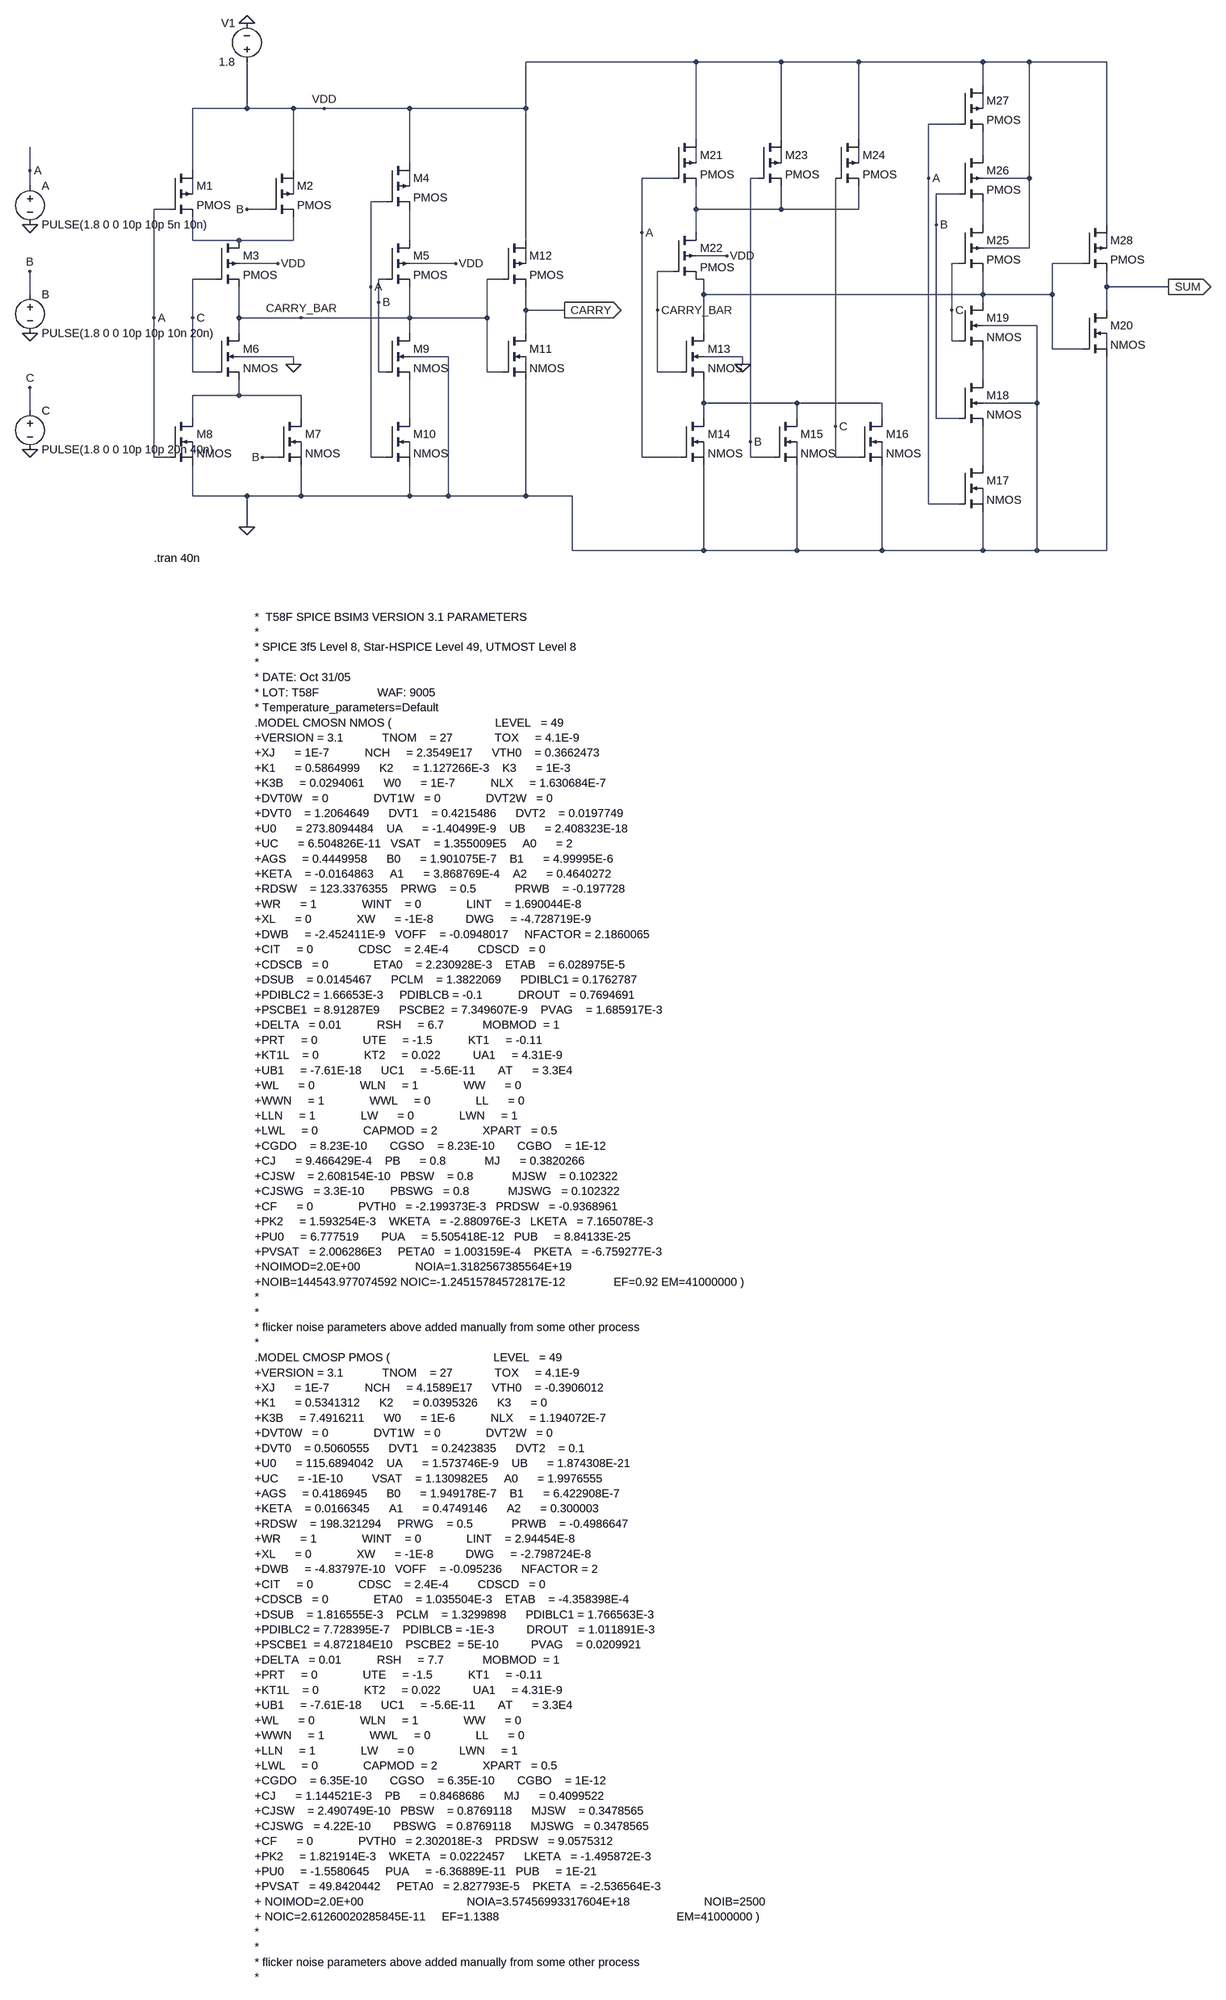
[diagram p0: schematic Implementation of Full adder using CMOS.asc]
Implementation of Full adder using CMOS.asc, the LTspice schematic file:
Version 4.1
SHEET 1 2128 3512
WIRE 1040 -176 688 -176
WIRE 1216 -176 1040 -176
WIRE 1376 -176 1216 -176
WIRE 1632 -176 1376 -176
WIRE 1728 -176 1632 -176
WIRE 1888 -176 1728 -176
WIRE 1632 -128 1632 -176
WIRE 112 -80 112 -176
WIRE 112 -80 0 -80
WIRE 208 -80 112 -80
WIRE 272 -80 208 -80
WIRE 448 -80 272 -80
WIRE 688 -80 688 -176
WIRE 688 -80 448 -80
WIRE 1632 -80 1632 -112
WIRE 1584 -48 1520 -48
WIRE 1040 -16 1040 -176
WIRE 1216 -16 1216 -176
WIRE 1376 -16 1376 -176
WIRE 1632 16 1632 -32
WIRE 448 32 448 -80
WIRE 1040 32 1040 0
WIRE 1216 32 1216 0
WIRE 1376 32 1376 0
WIRE -336 48 -336 0
WIRE 0 48 0 -80
WIRE 208 48 208 -80
WIRE 992 64 928 64
WIRE 1168 64 1152 64
WIRE 1520 64 1520 -48
WIRE 1728 64 1728 -176
WIRE 1728 64 1632 64
WIRE -336 80 -336 48
WIRE 448 80 448 48
WIRE 0 96 0 64
WIRE 208 96 208 64
WIRE 1584 96 1536 96
WIRE 400 112 368 112
WIRE -48 128 -80 128
WIRE 160 128 112 128
WIRE 1040 128 1040 80
WIRE 1216 128 1216 80
WIRE 1216 128 1040 128
WIRE 1376 128 1376 80
WIRE 1376 128 1216 128
WIRE 1536 160 1536 96
WIRE 1632 160 1632 112
WIRE 1888 160 1888 -176
WIRE 928 176 928 64
WIRE 1040 176 1040 128
WIRE 0 192 0 144
WIRE 96 192 0 192
WIRE 208 192 208 144
WIRE 208 192 96 192
WIRE 448 192 448 128
WIRE 688 192 688 -80
WIRE 1728 208 1728 64
WIRE 1728 208 1632 208
WIRE 1888 208 1888 176
WIRE 1104 224 1040 224
WIRE 176 240 96 240
WIRE 544 240 448 240
WIRE 688 240 688 208
WIRE 1584 240 1568 240
WIRE 1840 240 1776 240
WIRE 992 256 960 256
WIRE 48 272 0 272
WIRE 400 272 384 272
WIRE 640 272 608 272
WIRE 1056 272 1040 272
WIRE 368 288 368 112
WIRE 1888 288 1888 256
WIRE 2016 288 1888 288
WIRE -336 304 -336 256
WIRE 1056 304 1056 272
WIRE 1632 304 1632 256
WIRE 1632 304 1056 304
WIRE 1776 304 1776 240
WIRE 1776 304 1632 304
WIRE 384 320 384 272
WIRE 1632 320 1632 304
WIRE 688 336 688 288
WIRE 768 336 688 336
WIRE 960 336 960 256
WIRE 1568 336 1568 240
WIRE 1888 336 1888 288
WIRE -80 352 -80 128
WIRE 0 352 0 272
WIRE 96 352 96 288
WIRE 224 352 96 352
WIRE 448 352 448 288
WIRE 448 352 224 352
WIRE 608 352 608 272
WIRE 608 352 448 352
WIRE 1744 368 1632 368
WIRE 96 384 96 352
WIRE 448 384 448 352
WIRE 688 384 688 336
WIRE 1056 384 1056 304
WIRE 1568 400 1568 336
WIRE 1584 400 1568 400
WIRE 1776 416 1776 304
WIRE 1840 416 1776 416
WIRE 1888 416 1888 384
WIRE 208 432 96 432
WIRE 528 432 448 432
WIRE 1136 432 1056 432
WIRE 208 448 208 432
WIRE 1136 448 1136 432
WIRE 0 464 0 352
WIRE 48 464 0 464
WIRE 384 464 384 320
WIRE 400 464 384 464
WIRE 608 464 608 352
WIRE 640 464 608 464
WIRE 688 464 688 432
WIRE 960 464 960 336
WIRE 1008 464 960 464
WIRE 1632 480 1632 416
WIRE 96 512 96 480
WIRE 96 512 0 512
WIRE 224 512 96 512
WIRE 1056 528 1056 480
WIRE 1248 528 1056 528
WIRE 1424 528 1248 528
WIRE 1744 528 1744 368
WIRE 1744 528 1632 528
WIRE -336 544 -336 496
WIRE 0 560 0 512
WIRE 224 560 224 512
WIRE 448 560 448 480
WIRE 1056 560 1056 528
WIRE 1248 560 1248 528
WIRE 1424 560 1424 528
WIRE 1536 560 1536 160
WIRE 1584 560 1536 560
WIRE 1328 576 1328 64
WIRE 1152 608 1152 64
WIRE -80 640 -80 352
WIRE -48 640 -80 640
WIRE 0 640 0 608
WIRE 176 640 144 640
WIRE 224 640 224 608
WIRE 368 640 368 288
WIRE 400 640 368 640
WIRE 448 640 448 608
WIRE 928 640 928 176
WIRE 1008 640 928 640
WIRE 1056 640 1056 608
WIRE 1152 640 1152 608
WIRE 1200 640 1152 640
WIRE 1248 640 1248 608
WIRE 1328 640 1328 576
WIRE 1376 640 1328 640
WIRE 1424 640 1424 608
WIRE 1632 656 1632 576
WIRE 0 720 0 656
WIRE 112 720 0 720
WIRE 224 720 224 656
WIRE 224 720 112 720
WIRE 448 720 448 656
WIRE 448 720 224 720
WIRE 528 720 528 432
WIRE 528 720 448 720
WIRE 688 720 688 480
WIRE 688 720 528 720
WIRE 784 720 688 720
WIRE 1520 736 1520 64
WIRE 1584 736 1520 736
WIRE 1632 736 1632 704
WIRE 112 784 112 720
WIRE 784 832 784 720
WIRE 1056 832 1056 656
WIRE 1056 832 784 832
WIRE 1248 832 1248 656
WIRE 1248 832 1056 832
WIRE 1424 832 1424 656
WIRE 1424 832 1248 832
WIRE 1632 832 1632 752
WIRE 1632 832 1424 832
WIRE 1744 832 1744 528
WIRE 1744 832 1632 832
WIRE 1888 832 1888 432
WIRE 1888 832 1744 832
FLAG 208 448 0
FLAG 112 784 0
FLAG 112 -256 0
FLAG 1136 448 0
FLAG 2016 288 SUM
IOPIN 2016 288 Out
FLAG 768 336 CARRY
IOPIN 768 336 Out
FLAG 176 240 VDD
FLAG 544 240 VDD
FLAG 1104 224 VDD
FLAG 272 -80 VDD
FLAG -80 352 A
FLAG 368 288 A
FLAG 928 176 A
FLAG 1520 64 A
FLAG 112 128 B
FLAG 144 640 B
FLAG 384 320 B
FLAG 1152 608 B
FLAG 1536 160 B
FLAG 0 352 C
FLAG 1328 576 C
FLAG 1568 336 C
FLAG 224 352 CARRY_BAR
FLAG -336 160 0
FLAG -336 384 0
FLAG -336 624 0
FLAG -336 48 A
FLAG -336 256 B
FLAG -336 496 C
FLAG 960 336 CARRY_BAR
SYMBOL pmos4 -48 48 R0
SYMATTR InstName M1
SYMBOL pmos4 160 48 R0
SYMATTR InstName M2
SYMBOL pmos4 48 192 R0
SYMATTR InstName M3
SYMBOL pmos4 400 32 R0
SYMATTR InstName M4
SYMBOL pmos4 400 192 R0
SYMATTR InstName M5
SYMBOL nmos4 48 384 R0
SYMATTR InstName M6
SYMBOL nmos4 -48 560 R0
SYMATTR InstName M8
SYMBOL nmos4 176 560 R0
SYMATTR InstName M7
SYMBOL nmos4 400 384 R0
SYMATTR InstName M9
SYMBOL nmos4 400 560 R0
SYMATTR InstName M10
SYMBOL nmos4 640 384 R0
SYMATTR InstName M11
SYMBOL pmos4 640 192 R0
SYMATTR InstName M12
SYMBOL voltage 112 -160 R180
WINDOW 0 24 96 Left 2
WINDOW 3 24 16 Left 2
WINDOW 123 0 0 Left 0
WINDOW 39 0 0 Left 0
SYMATTR InstName V1
SYMATTR Value 1.8
SYMBOL nmos4 1008 384 R0
SYMATTR InstName M13
SYMBOL nmos4 1008 560 R0
SYMATTR InstName M14
SYMBOL nmos4 1200 560 R0
SYMATTR InstName M15
SYMBOL nmos4 1376 560 R0
SYMATTR InstName M16
SYMBOL nmos4 1584 656 R0
SYMATTR InstName M17
SYMBOL nmos4 1584 480 R0
SYMATTR InstName M18
SYMBOL nmos4 1584 320 R0
SYMATTR InstName M19
SYMBOL nmos4 1840 336 R0
SYMATTR InstName M20
SYMBOL pmos4 992 -16 R0
SYMATTR InstName M21
SYMBOL pmos4 992 176 R0
SYMATTR InstName M22
SYMBOL pmos4 1168 -16 R0
SYMATTR InstName M23
SYMBOL pmos4 1328 -16 R0
SYMATTR InstName M24
SYMBOL pmos4 1584 160 R0
SYMATTR InstName M25
SYMBOL pmos4 1584 16 R0
SYMATTR InstName M26
SYMBOL pmos4 1584 -128 R0
SYMATTR InstName M27
SYMBOL pmos4 1840 160 R0
SYMATTR InstName M28
SYMBOL voltage -336 64 R0
WINDOW 123 0 0 Left 0
WINDOW 39 0 0 Left 0
SYMATTR InstName A
SYMATTR Value PULSE(1.8 0 0 10p 10p 5n 10n)
SYMBOL voltage -336 288 R0
WINDOW 123 0 0 Left 0
WINDOW 39 0 0 Left 0
SYMATTR InstName B
SYMATTR Value PULSE(1.8 0 0 10p 10p 10n 20n)
SYMBOL voltage -336 528 R0
WINDOW 123 0 0 Left 0
WINDOW 39 0 0 Left 0
SYMATTR InstName C
SYMATTR Value PULSE(1.8 0 0 10p 10p 20n 40n)
TEXT -80 848 Left 2 !.tran 40n
TEXT 128 976 Left 2 !*  T58F SPICE BSIM3 VERSION 3.1 PARAMETERS\n* \n* SPICE 3f5 Level 8, Star-HSPICE Level 49, UTMOST Level 8\n* \n* DATE: Oct 31/05\n* LOT: T58F                  WAF: 9005\n* Temperature_parameters=Default\n.MODEL CMOSN NMOS (                                LEVEL   = 49\n+VERSION = 3.1            TNOM    = 27             TOX     = 4.1E-9\n+XJ      = 1E-7           NCH     = 2.3549E17      VTH0    = 0.3662473\n+K1      = 0.5864999      K2      = 1.127266E-3    K3      = 1E-3\n+K3B     = 0.0294061      W0      = 1E-7           NLX     = 1.630684E-7\n+DVT0W   = 0              DVT1W   = 0              DVT2W   = 0\n+DVT0    = 1.2064649      DVT1    = 0.4215486      DVT2    = 0.0197749\n+U0      = 273.8094484    UA      = -1.40499E-9    UB      = 2.408323E-18\n+UC      = 6.504826E-11   VSAT    = 1.355009E5     A0      = 2\n+AGS     = 0.4449958      B0      = 1.901075E-7    B1      = 4.99995E-6\n+KETA    = -0.0164863     A1      = 3.868769E-4    A2      = 0.4640272\n+RDSW    = 123.3376355    PRWG    = 0.5            PRWB    = -0.197728\n+WR      = 1              WINT    = 0              LINT    = 1.690044E-8\n+XL      = 0              XW      = -1E-8          DWG     = -4.728719E-9\n+DWB     = -2.452411E-9   VOFF    = -0.0948017     NFACTOR = 2.1860065\n+CIT     = 0              CDSC    = 2.4E-4         CDSCD   = 0\n+CDSCB   = 0              ETA0    = 2.230928E-3    ETAB    = 6.028975E-5\n+DSUB    = 0.0145467      PCLM    = 1.3822069      PDIBLC1 = 0.1762787\n+PDIBLC2 = 1.66653E-3     PDIBLCB = -0.1           DROUT   = 0.7694691\n+PSCBE1  = 8.91287E9      PSCBE2  = 7.349607E-9    PVAG    = 1.685917E-3\n+DELTA   = 0.01           RSH     = 6.7            MOBMOD  = 1\n+PRT     = 0              UTE     = -1.5           KT1     = -0.11\n+KT1L    = 0              KT2     = 0.022          UA1     = 4.31E-9\n+UB1     = -7.61E-18      UC1     = -5.6E-11       AT      = 3.3E4\n+WL      = 0              WLN     = 1              WW      = 0\n+WWN     = 1              WWL     = 0              LL      = 0\n+LLN     = 1              LW      = 0              LWN     = 1\n+LWL     = 0              CAPMOD  = 2              XPART   = 0.5\n+CGDO    = 8.23E-10       CGSO    = 8.23E-10       CGBO    = 1E-12\n+CJ      = 9.466429E-4    PB      = 0.8            MJ      = 0.3820266\n+CJSW    = 2.608154E-10   PBSW    = 0.8            MJSW    = 0.102322\n+CJSWG   = 3.3E-10        PBSWG   = 0.8            MJSWG   = 0.102322\n+CF      = 0              PVTH0   = -2.199373E-3   PRDSW   = -0.9368961\n+PK2     = 1.593254E-3    WKETA   = -2.880976E-3   LKETA   = 7.165078E-3\n+PU0     = 6.777519       PUA     = 5.505418E-12   PUB     = 8.84133E-25\n+PVSAT   = 2.006286E3     PETA0   = 1.003159E-4    PKETA   = -6.759277E-3\n+NOIMOD=2.0E+00                 NOIA=1.3182567385564E+19\n+NOIB=144543.977074592 NOIC=-1.24515784572817E-12               EF=0.92 EM=41000000 )\n*\n*\n* flicker noise parameters above added manually from some other process\n* \n.MODEL CMOSP PMOS (                                LEVEL   = 49\n+VERSION = 3.1            TNOM    = 27             TOX     = 4.1E-9\n+XJ      = 1E-7           NCH     = 4.1589E17      VTH0    = -0.3906012\n+K1      = 0.5341312      K2      = 0.0395326      K3      = 0\n+K3B     = 7.4916211      W0      = 1E-6           NLX     = 1.194072E-7\n+DVT0W   = 0              DVT1W   = 0              DVT2W   = 0\n+DVT0    = 0.5060555      DVT1    = 0.2423835      DVT2    = 0.1\n+U0      = 115.6894042    UA      = 1.573746E-9    UB      = 1.874308E-21\n+UC      = -1E-10         VSAT    = 1.130982E5     A0      = 1.9976555\n+AGS     = 0.4186945      B0      = 1.949178E-7    B1      = 6.422908E-7\n+KETA    = 0.0166345      A1      = 0.4749146      A2      = 0.300003\n+RDSW    = 198.321294     PRWG    = 0.5            PRWB    = -0.4986647\n+WR      = 1              WINT    = 0              LINT    = 2.94454E-8\n+XL      = 0              XW      = -1E-8          DWG     = -2.798724E-8\n+DWB     = -4.83797E-10   VOFF    = -0.095236      NFACTOR = 2\n+CIT     = 0              CDSC    = 2.4E-4         CDSCD   = 0\n+CDSCB   = 0              ETA0    = 1.035504E-3    ETAB    = -4.358398E-4\n+DSUB    = 1.816555E-3    PCLM    = 1.3299898      PDIBLC1 = 1.766563E-3\n+PDIBLC2 = 7.728395E-7    PDIBLCB = -1E-3          DROUT   = 1.011891E-3\n+PSCBE1  = 4.872184E10    PSCBE2  = 5E-10          PVAG    = 0.0209921\n+DELTA   = 0.01           RSH     = 7.7            MOBMOD  = 1\n+PRT     = 0              UTE     = -1.5           KT1     = -0.11\n+KT1L    = 0              KT2     = 0.022          UA1     = 4.31E-9\n+UB1     = -7.61E-18      UC1     = -5.6E-11       AT      = 3.3E4\n+WL      = 0              WLN     = 1              WW      = 0\n+WWN     = 1              WWL     = 0              LL      = 0\n+LLN     = 1              LW      = 0              LWN     = 1\n+LWL     = 0              CAPMOD  = 2              XPART   = 0.5\n+CGDO    = 6.35E-10       CGSO    = 6.35E-10       CGBO    = 1E-12\n+CJ      = 1.144521E-3    PB      = 0.8468686      MJ      = 0.4099522\n+CJSW    = 2.490749E-10   PBSW    = 0.8769118      MJSW    = 0.3478565\n+CJSWG   = 4.22E-10       PBSWG   = 0.8769118      MJSWG   = 0.3478565\n+CF      = 0              PVTH0   = 2.302018E-3    PRDSW   = 9.0575312\n+PK2     = 1.821914E-3    WKETA   = 0.0222457      LKETA   = -1.495872E-3\n+PU0     = -1.5580645     PUA     = -6.36889E-11   PUB     = 1E-21\n+PVSAT   = 49.8420442     PETA0   = 2.827793E-5    PKETA   = -2.536564E-3 \n+ NOIMOD=2.0E+00                                NOIA=3.57456993317604E+18                       NOIB=2500\n+ NOIC=2.61260020285845E-11     EF=1.1388                                                       EM=41000000 )\n*\n*\n* flicker noise parameters above added manually from some other process\n*

The netlist it stands for:
* Implementation of Full adder using CMOS.asc
M1 VDD A N011 N007 PMOS
M2 VDD B N011 N008 PMOS
M3 N011 C CARRY_BAR VDD PMOS
M4 VDD A N012 N006 PMOS
M5 N012 B CARRY_BAR VDD PMOS
M6 CARRY_BAR C N019 0 NMOS
M8 N019 A 0 N022 NMOS
M7 N019 B 0 N023 NMOS
M9 CARRY_BAR B N021 0 NMOS
M10 N021 A 0 N024 NMOS
M11 CARRY CARRY_BAR 0 N017 NMOS
M12 VDD CARRY_BAR CARRY N014 PMOS
V1 VDD 0 1.8
M13 N015 CARRY_BAR N020 0 NMOS
M14 N020 A 0 N025 NMOS
M15 N020 B 0 N026 NMOS
M16 N020 C 0 N027 NMOS
M17 N028 A 0 N029 NMOS
M18 N018 B N028 0 NMOS
M19 N015 C N018 0 NMOS
M20 SUM N015 0 N016 NMOS
M21 VDD A N009 N003 PMOS
M22 N009 CARRY_BAR N015 VDD PMOS
M23 VDD B N009 N004 PMOS
M24 VDD C N009 N005 PMOS
M25 N010 C N015 VDD PMOS
M26 N002 B N010 VDD PMOS
M27 VDD A N002 N001 PMOS
M28 VDD N015 SUM N013 PMOS
V§A A 0 PULSE(1.8 0 0 10p 10p 5n 10n)
V§B B 0 PULSE(1.8 0 0 10p 10p 10n 20n)
V§C C 0 PULSE(1.8 0 0 10p 10p 20n 40n)
.model NMOS NMOS
.model PMOS PMOS
.lib standard.mos
.tran 40n
*  T58F SPICE BSIM3 VERSION 3.1 PARAMETERS
*
* SPICE 3f5 Level 8, Star-HSPICE Level 49, UTMOST Level 8
*
* DATE: Oct 31/05
* LOT: T58F                  WAF: 9005
* Temperature_parameters=Default
.MODEL CMOSN NMOS (                                LEVEL   = 49
+VERSION = 3.1            TNOM    = 27             TOX     = 4.1E-9
+XJ      = 1E-7           NCH     = 2.3549E17      VTH0    = 0.3662473
+K1      = 0.5864999      K2      = 1.127266E-3    K3      = 1E-3
+K3B     = 0.0294061      W0      = 1E-7           NLX     = 1.630684E-7
+DVT0W   = 0              DVT1W   = 0              DVT2W   = 0
+DVT0    = 1.2064649      DVT1    = 0.4215486      DVT2    = 0.0197749
+U0      = 273.8094484    UA      = -1.40499E-9    UB      = 2.408323E-18
+UC      = 6.504826E-11   VSAT    = 1.355009E5     A0      = 2
+AGS     = 0.4449958      B0      = 1.901075E-7    B1      = 4.99995E-6
+KETA    = -0.0164863     A1      = 3.868769E-4    A2      = 0.4640272
+RDSW    = 123.3376355    PRWG    = 0.5            PRWB    = -0.197728
+WR      = 1              WINT    = 0              LINT    = 1.690044E-8
+XL      = 0              XW      = -1E-8          DWG     = -4.728719E-9
+DWB     = -2.452411E-9   VOFF    = -0.0948017     NFACTOR = 2.1860065
+CIT     = 0              CDSC    = 2.4E-4         CDSCD   = 0
+CDSCB   = 0              ETA0    = 2.230928E-3    ETAB    = 6.028975E-5
+DSUB    = 0.0145467      PCLM    = 1.3822069      PDIBLC1 = 0.1762787
+PDIBLC2 = 1.66653E-3     PDIBLCB = -0.1           DROUT   = 0.7694691
+PSCBE1  = 8.91287E9      PSCBE2  = 7.349607E-9    PVAG    = 1.685917E-3
+DELTA   = 0.01           RSH     = 6.7            MOBMOD  = 1
+PRT     = 0              UTE     = -1.5           KT1     = -0.11
+KT1L    = 0              KT2     = 0.022          UA1     = 4.31E-9
+UB1     = -7.61E-18      UC1     = -5.6E-11       AT      = 3.3E4
+WL      = 0              WLN     = 1              WW      = 0
+WWN     = 1              WWL     = 0              LL      = 0
+LLN     = 1              LW      = 0              LWN     = 1
+LWL     = 0              CAPMOD  = 2              XPART   = 0.5
+CGDO    = 8.23E-10       CGSO    = 8.23E-10       CGBO    = 1E-12
+CJ      = 9.466429E-4    PB      = 0.8            MJ      = 0.3820266
+CJSW    = 2.608154E-10   PBSW    = 0.8            MJSW    = 0.102322
+CJSWG   = 3.3E-10        PBSWG   = 0.8            MJSWG   = 0.102322
+CF      = 0              PVTH0   = -2.199373E-3   PRDSW   = -0.9368961
+PK2     = 1.593254E-3    WKETA   = -2.880976E-3   LKETA   = 7.165078E-3
+PU0     = 6.777519       PUA     = 5.505418E-12   PUB     = 8.84133E-25
+PVSAT   = 2.006286E3     PETA0   = 1.003159E-4    PKETA   = -6.759277E-3
+NOIMOD=2.0E+00                 NOIA=1.3182567385564E+19
+NOIB=144543.977074592 NOIC=-1.24515784572817E-12               EF=0.92 EM=41000000 )
*
*
* flicker noise parameters above added manually from some other process
*
.MODEL CMOSP PMOS (                                LEVEL   = 49
+VERSION = 3.1            TNOM    = 27             TOX     = 4.1E-9
+XJ      = 1E-7           NCH     = 4.1589E17      VTH0    = -0.3906012
+K1      = 0.5341312      K2      = 0.0395326      K3      = 0
+K3B     = 7.4916211      W0      = 1E-6           NLX     = 1.194072E-7
+DVT0W   = 0              DVT1W   = 0              DVT2W   = 0
+DVT0    = 0.5060555      DVT1    = 0.2423835      DVT2    = 0.1
+U0      = 115.6894042    UA      = 1.573746E-9    UB      = 1.874308E-21
+UC      = -1E-10         VSAT    = 1.130982E5     A0      = 1.9976555
+AGS     = 0.4186945      B0      = 1.949178E-7    B1      = 6.422908E-7
+KETA    = 0.0166345      A1      = 0.4749146      A2      = 0.300003
+RDSW    = 198.321294     PRWG    = 0.5            PRWB    = -0.4986647
+WR      = 1              WINT    = 0              LINT    = 2.94454E-8
+XL      = 0              XW      = -1E-8          DWG     = -2.798724E-8
+DWB     = -4.83797E-10   VOFF    = -0.095236      NFACTOR = 2
+CIT     = 0              CDSC    = 2.4E-4         CDSCD   = 0
+CDSCB   = 0              ETA0    = 1.035504E-3    ETAB    = -4.358398E-4
+DSUB    = 1.816555E-3    PCLM    = 1.3299898      PDIBLC1 = 1.766563E-3
+PDIBLC2 = 7.728395E-7    PDIBLCB = -1E-3          DROUT   = 1.011891E-3
+PSCBE1  = 4.872184E10    PSCBE2  = 5E-10          PVAG    = 0.0209921
+DELTA   = 0.01           RSH     = 7.7            MOBMOD  = 1
+PRT     = 0              UTE     = -1.5           KT1     = -0.11
+KT1L    = 0              KT2     = 0.022          UA1     = 4.31E-9
+UB1     = -7.61E-18      UC1     = -5.6E-11       AT      = 3.3E4
+WL      = 0              WLN     = 1              WW      = 0
+WWN     = 1              WWL     = 0              LL      = 0
+LLN     = 1              LW      = 0              LWN     = 1
+LWL     = 0              CAPMOD  = 2              XPART   = 0.5
+CGDO    = 6.35E-10       CGSO    = 6.35E-10       CGBO    = 1E-12
+CJ      = 1.144521E-3    PB      = 0.8468686      MJ      = 0.4099522
+CJSW    = 2.490749E-10   PBSW    = 0.8769118      MJSW    = 0.3478565
+CJSWG   = 4.22E-10       PBSWG   = 0.8769118      MJSWG   = 0.3478565
+CF      = 0              PVTH0   = 2.302018E-3    PRDSW   = 9.0575312
+PK2     = 1.821914E-3    WKETA   = 0.0222457      LKETA   = -1.495872E-3
+PU0     = -1.5580645     PUA     = -6.36889E-11   PUB     = 1E-21
+PVSAT   = 49.8420442     PETA0   = 2.827793E-5    PKETA   = -2.536564E-3
+ NOIMOD=2.0E+00                                NOIA=3.57456993317604E+18                       NOIB=2500
+ NOIC=2.61260020285845E-11     EF=1.1388                                                       EM=41000000 )
*
*
* flicker noise parameters above added manually from some other process
*
.backanno
.end